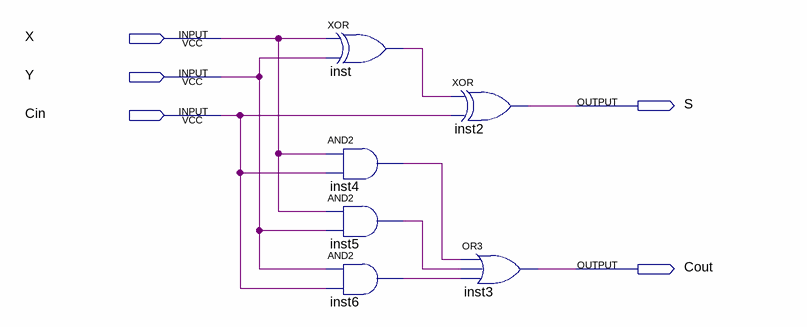
[diagram p0: schematic sheet]
// Quartus schematic OnebitAdder.bdf as structural Verilog: 6 symbols, 5 pins
module OnebitAdder (
  input  X,
  input  Y,
  input  Cin,
  output S,
  output Cout
);

  wire inst4_out, inst5_out, inst6_out, inst_out;

  xor inst (inst_out, X, Y);
  and inst4 (inst4_out, X, Cin);
  and inst5 (inst5_out, X, Y);
  and inst6 (inst6_out, Y, Cin);
  xor inst2 (S, inst_out, Cin);
  or inst3 (Cout, inst4_out, inst5_out, inst6_out);
endmodule
